# Altium project Diagram.PrjPcb
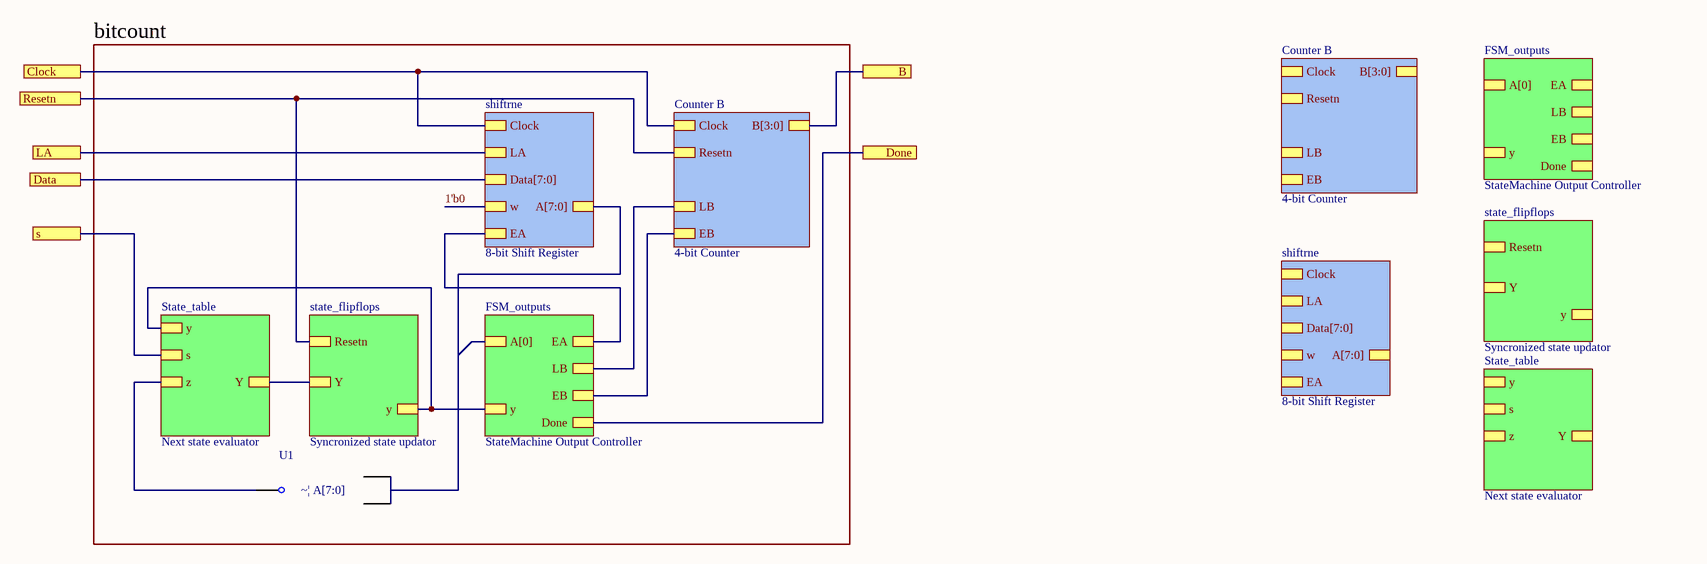
[diagram p0: Diagram.SchDoc]
1 sheet, 1 parts. Net scope: hierarchical (ports join the sheet entries above them; power ports are global).

## Sheet Diagram.SchDoc
size A3; SheetNumber: 1; SheetTotal: 1

### Parts
U1  Digital NOR Gate  (value not drawn)

### Blocks framed on the sheet
bitcount: U1

### Sub-sheets
Counter B = File Name (file not in this document): Resetn, Clock, B[3:0], LB, EB
Counter B = File Name (file not in this document): Resetn, Clock, B[3:0], LB, EB
FSM_outputs = File Name (file not in this document): y, A[0], EA, EB, Done, LB
FSM_outputs = File Name (file not in this document): y, A[0], EA, EB, Done, LB
shiftrne = File Name (file not in this document): Data[7:0], LA, EA, w, Clock, A[7:0]
shiftrne = File Name (file not in this document): Data[7:0], LA, EA, w, Clock, A[7:0]
state_flipflops = File Name (file not in this document): Resetn, Y, y
state_flipflops = File Name (file not in this document): Resetn, Y, y
State_table = File Name (file not in this document): s, y, z, Y
State_table = File Name (file not in this document): s, y, z, Y

### Ports
B, Clock, Data, Done, LA, Resetn, s

### Nets
1'b0: sheet shiftrne/w
NetU1_3: U1.3 ; sheet State_table/z
(unnamed): port Clock, sheet Counter B/Clock, sheet shiftrne/Clock
(unnamed): port Resetn, sheet Counter B/Resetn, sheet state_flipflops/Resetn
(unnamed): port LA, sheet shiftrne/LA
(unnamed): port Done, sheet FSM_outputs/Done
(unnamed): port s, sheet State_table/s
(unnamed): sheet Counter B/LB, sheet FSM_outputs/LB
(unnamed): sheet Counter B/EB, sheet FSM_outputs/EB
(unnamed): sheet shiftrne/EA, sheet FSM_outputs/EA
(unnamed): sheet FSM_outputs/y, sheet State_table/y, sheet state_flipflops/y
(unnamed): sheet State_table/Y, sheet state_flipflops/Y

Not connected (* = marked no-connect by the designer): U1 1 2

### Buses and harness runs
bus port B = sheet Counter B/B[3:0]
bus port Data = sheet shiftrne/Data[7:0]

### Notes on the sheet
- 4-bit Counter
- StateMachine Output Controller
- 8-bit Shift Register
- Syncronized state updator
- (near U1) Next state evaluator
- (near U1) Syncronized state updator
- (near U1) ~| A[7:0]
- Next state evaluator

### Library data of the parts
U1 = Digital NOR: rise_delay_inst: 1n; input_load_inst: 1p; adc_in_low_inst: 0; adc_in_high_inst: 1; dac_out_undef_inst: 0.5; SimulationGenericComponent: True; fall_delay_inst: 1n; adc_rise_delay_inst: 1n; adc_fall_delay_inst: 1n; dac_out_low_inst: 0; dac_out_high_inst: 1; dac_input_load_inst: 1p; dac_t_rise_inst: 1n; dac_t_fall_inst: 1n